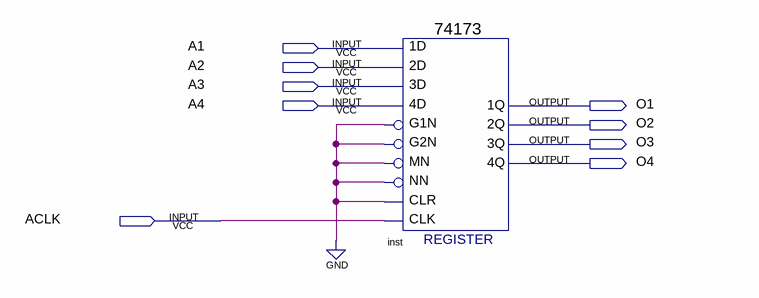
[diagram p0: schematic sheet]
// Quartus schematic 173test.bdf as structural Verilog: 1 symbols, 9 pins
module \173test  (
  input  A1,
  input  A2,
  input  A3,
  input  A4,
  input  ACLK,
  output O1,
  output O2,
  output O3,
  output O4
);

  \74173  inst (
    .\3D (A3), .MN(1'b0), .\1D (A1), .\2D (A2), .\4D (A4), .G1N(1'b0), .G2N(1'b0), .NN(1'b0), .CLR(1'b0),
    .CLK(ACLK), .\3Q (O3), .\2Q (O2), .\1Q (O1), .\4Q (O4));
endmodule
